# Altium project ADS1299MFMv1.PrjPcb
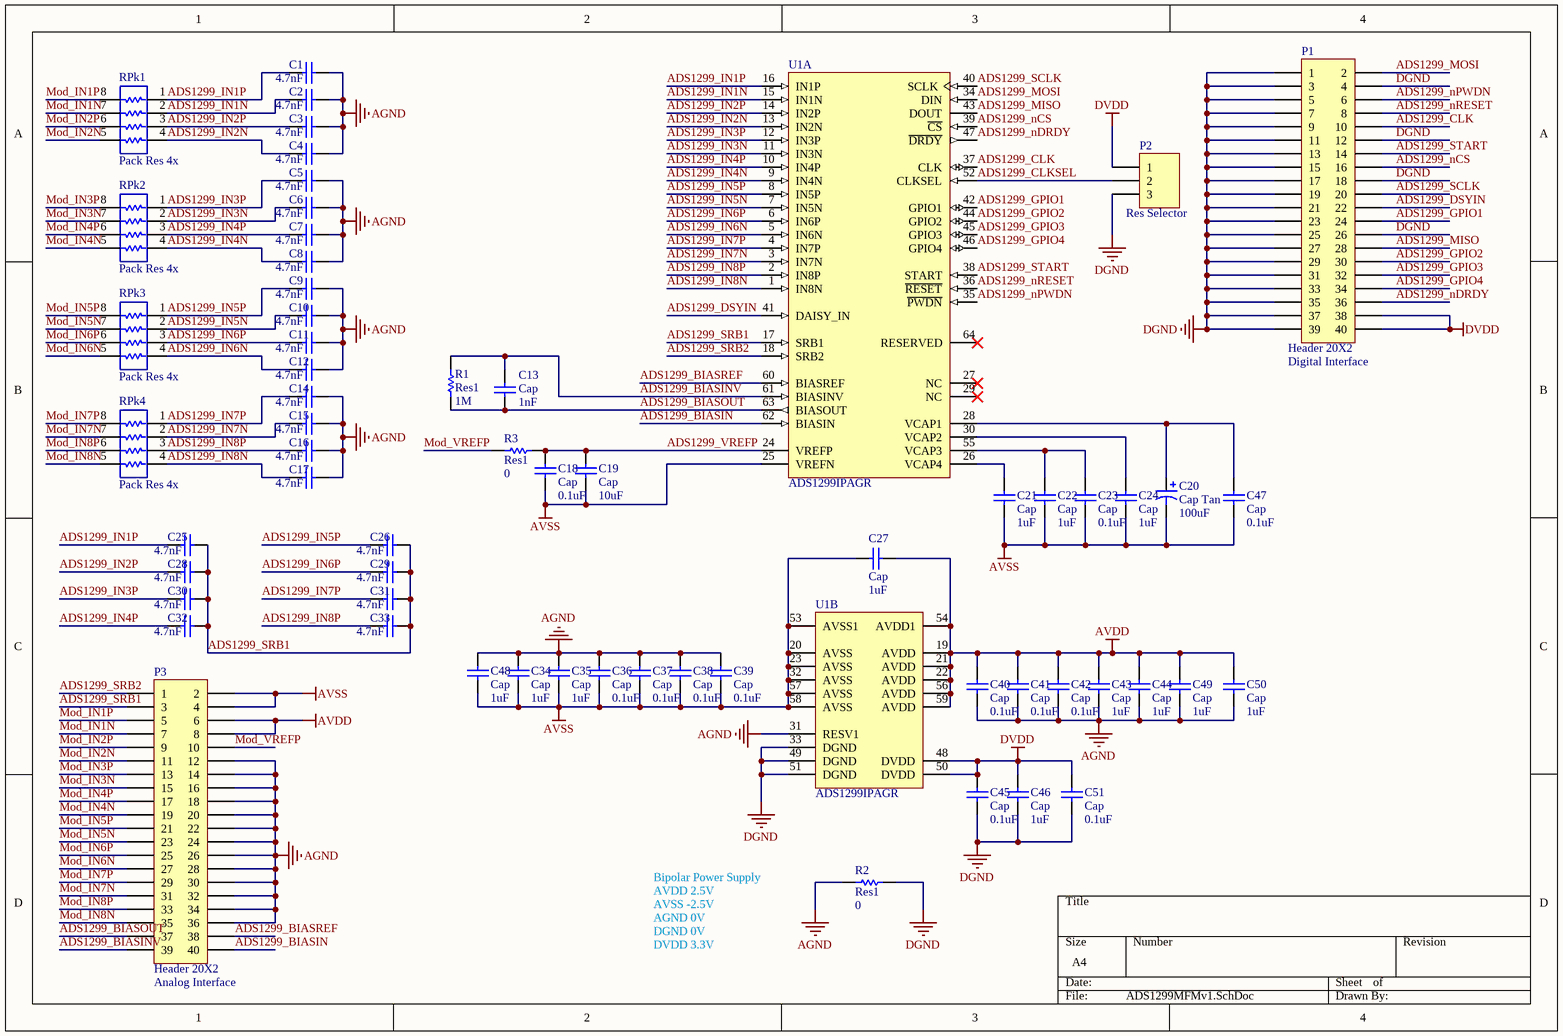
[diagram p0: ADS1299MFMv1.SchDoc]
1 sheet, 63 parts. Net scope: global (net labels, ports and power ports of the same name join across sheets).
Board file: ADS1299MFMv1.PcbDoc

## Sheet ADS1299MFMv1.SchDoc: ADS1299 Minimum Functional Module
size A4

### Parts
(Parts that share a designator on the sheet are numbered #1, #2 ... from top to bottom, then left to right.)
C1  value 4.7nF  [RESC1005N]  (hidden comment: Cap)
C2  value 4.7nF  [RESC1005N]  (hidden comment: Cap)
C3  value 4.7nF  [RESC1005N]  (hidden comment: Cap)
C4  value 4.7nF  [RESC1005N]  (hidden comment: Cap)
C5  value 4.7nF  [RESC1005N]  (hidden comment: Cap)
C6  value 4.7nF  [RESC1005N]  (hidden comment: Cap)
C7  value 4.7nF  [RESC1005N]  (hidden comment: Cap)
C8  value 4.7nF  [RESC1005N]  (hidden comment: Cap)
C9  value 4.7nF  [RESC1005N]  (hidden comment: Cap)
C10  value 4.7nF  [RESC1005N]  (hidden comment: Cap)
C11  value 4.7nF  [RESC1005N]  (hidden comment: Cap)
C12  value 4.7nF  [RESC1005N]  (hidden comment: Cap)
C13  Cap  value 1nF  [RESC1608N]
C14  value 4.7nF  [RESC1005N]  (hidden comment: Cap)
C15  value 4.7nF  [RESC1005N]  (hidden comment: Cap)
C16  value 4.7nF  [RESC1005N]  (hidden comment: Cap)
C17  value 4.7nF  [RESC1005N]  (hidden comment: Cap)
C18  Cap  value 0.1uF  [RESC1005N]
C19  Cap  value 10uF  [RESC1608N]
C20  Cap Tan  value 100uF  [TC3528-1411]
C21  Cap  value 1uF  [RESC1608N]
C22  Cap  value 1uF  [RESC1608N]
C23  Cap  value 0.1uF  [RESC1005N]
C24  Cap  value 1uF  [RESC1608N]
C25  value 4.7nF  [RESC1005N]  (hidden comment: Cap)
C26  value 4.7nF  [RESC1005N]  (hidden comment: Cap)
C27  Cap  value 1uF  [RESC1608N]
C28  value 4.7nF  [RESC1005N]  (hidden comment: Cap)
C29  value 4.7nF  [RESC1005N]  (hidden comment: Cap)
C30  value 4.7nF  [RESC1005N]  (hidden comment: Cap)
C31  value 4.7nF  [RESC1005N]  (hidden comment: Cap)
C32  value 4.7nF  [RESC1005N]  (hidden comment: Cap)
C33  value 4.7nF  [RESC1005N]  (hidden comment: Cap)
C34  Cap  value 1uF  [RESC1608N]
C35  Cap  value 1uF  [RESC1608N]
C36  Cap  value 0.1uF  [RESC1005N]
C37  Cap  value 0.1uF  [RESC1005N]
C38  Cap  value 0.1uF  [RESC1005N]
C39  Cap  value 0.1uF  [RESC1005N]
C40  Cap  value 0.1uF  [RESC1005N]
C41  Cap  value 0.1uF  [RESC1005N]
C42  Cap  value 0.1uF  [RESC1005N]
C43  Cap  value 1uF  [RESC1608N]
C44  Cap  value 1uF  [RESC1608N]
C45  Cap  value 0.1uF  [RESC1005N]
C46  Cap  value 1uF  [RESC1608N]
C47  Cap  value 0.1uF  [RESC1005N]
C48  Cap  value 1uF  [RESC1608N]
C49  Cap  value 1uF  [RESC1608N]
C50  Cap  value 1uF  [RESC1608N]
C51  Cap  value 0.1uF  [RESC1005N]
P1  Header 20X2  [FCI-B2B-0.8mm-40p]
P2  Res Selector  [RESSEL1608N]
P3  Header 20X2  [FCI-B2B-0.8mm-40p]
R1  Res1  value 1M  [RESC1608N]
R2  Res1  value 0  [RESC3216N]
R3  Res1  value 0  [RESC1608N]
RPk1  Pack Res 4x  [4X0603]
RPk2  Pack Res 4x  [4X0603]
RPk3  Pack Res 4x  [4X0603]
RPk4  Pack Res 4x  [4X0603]
U1#1  ADS1299IPAGR  [PAG0064A_L]  (part A of 2)
U1#2  ADS1299IPAGR  [PAG0064A_L]  (part B of 2)

### Nets
AGND: C1.2 C2.2 C3.2 C4.2 C5.2 C6.2 C7.2 C8.2 C9.2 C10.2 C11.2 C12.2 C14.2 C15.2 C16.2 C17.2 C34.2 C35.2 C36.2 C37.2 C38.2 C39.2 C40.1 C41.1 C42.1 C43.1 C44.1 C48.2 C49.1 C50.1 P3.12 P3.14 P3.16 P3.18 P3.20 P3.22 P3.24 P3.26 P3.28 P3.30 P3.32 P3.34 P3.36 R2.1 U1#2.31(RESV1)
AVDD: C27.1 C40.2 C41.2 C42.2 C43.2 C44.2 C49.2 C50.2 P3.6 P3.8 U1#2.19(AVDD) U1#2.21(AVDD) U1#2.22(AVDD) U1#2.54(AVDD1) U1#2.56(AVDD) U1#2.59(AVDD)
AVSS: C18.1 C19.1 C20.2 C21.1 C22.1 C23.1 C24.1 C27.2 C34.1 C35.1 C36.1 C37.1 C38.1 C39.1 C47.1 C48.1 P3.2 P3.4 U1#1.25(VREFN) U1#2.20(AVSS) U1#2.23(AVSS) U1#2.32(AVSS) U1#2.53(AVSS1) U1#2.57(AVSS) U1#2.58(AVSS)
DGND: C45.1 C46.1 C51.1 P1.1 P1.3 P1.4 P1.5 P1.7 P1.9 P1.11 P1.12 P1.13 P1.15 P1.17 P1.18 P1.19 P1.21 P1.23 P1.25 P1.26 P1.27 P1.29 P1.31 P1.33 P1.35 P1.37 P1.39 P2.3 R2.2 U1#2.33(DGND) U1#2.49(DGND) U1#2.51(DGND)
DVDD: C45.2 C46.2 C51.2 P1.38 P1.40 P2.1 U1#2.48(DVDD) U1#2.50(DVDD)
ADS1299_BIASIN: P3.40 U1#1.62(BIASIN)
ADS1299_BIASINV: C13.2 P3.39 R1.2 U1#1.61(BIASINV)
ADS1299_BIASOUT: C13.1 P3.37 R1.1 U1#1.63(BIASOUT)
ADS1299_BIASREF: P3.38 U1#1.60(BIASREF)
ADS1299_CLK: P1.10 U1#1.37(CLK)
ADS1299_CLKSEL: P2.2 U1#1.52(CLKSEL)
ADS1299_DSYIN: P1.22 U1#1.41(DAISY_IN)
ADS1299_GPIO1: P1.24 U1#1.42(GPIO1)
ADS1299_GPIO2: P1.30 U1#1.44(GPIO2)
ADS1299_GPIO3: P1.32 U1#1.45(GPIO3)
ADS1299_GPIO4: P1.34 U1#1.46(GPIO4)
ADS1299_IN1N: C2.1 RPk1.2 U1#1.15(IN1N)
ADS1299_IN1P: C1.1 C25.1 RPk1.1 U1#1.16(IN1P)
ADS1299_IN2N: C4.1 RPk1.4 U1#1.13(IN2N)
ADS1299_IN2P: C3.1 C28.1 RPk1.3 U1#1.14(IN2P)
ADS1299_IN3N: C6.1 RPk2.2 U1#1.11(IN3N)
ADS1299_IN3P: C5.1 C30.1 RPk2.1 U1#1.12(IN3P)
ADS1299_IN4N: C8.1 RPk2.4 U1#1.9(IN4N)
ADS1299_IN4P: C7.1 C32.1 RPk2.3 U1#1.10(IN4P)
ADS1299_IN5N: C10.1 RPk3.2 U1#1.7(IN5N)
ADS1299_IN5P: C9.1 C26.1 RPk3.1 U1#1.8(IN5P)
ADS1299_IN6N: C12.1 RPk3.4 U1#1.5(IN6N)
ADS1299_IN6P: C11.1 C29.1 RPk3.3 U1#1.6(IN6P)
ADS1299_IN7N: C15.1 RPk4.2 U1#1.3(IN7N)
ADS1299_IN7P: C14.1 C31.1 RPk4.1 U1#1.4(IN7P)
ADS1299_IN8N: C17.1 RPk4.4 U1#1.1(IN8N)
ADS1299_IN8P: C16.1 C33.1 RPk4.3 U1#1.2(IN8P)
ADS1299_MISO: P1.28 U1#1.43(DOUT)
ADS1299_MOSI: P1.2 U1#1.34(DIN)
ADS1299_nCS: P1.16 U1#1.39(~{CS})
ADS1299_nDRDY: P1.36 U1#1.47(~{DRDY})
ADS1299_nPWDN: P1.6 U1#1.35(~{PWDN})
ADS1299_nRESET: P1.8 U1#1.36(~{RESET})
ADS1299_SCLK: P1.20 U1#1.40(SCLK)
ADS1299_SRB1: C25.2 C26.2 C28.2 C29.2 C30.2 C31.2 C32.2 C33.2 P3.3 U1#1.17(SRB1)
ADS1299_SRB2: P3.1 U1#1.18(SRB2)
ADS1299_START: P1.14 U1#1.38(START)
ADS1299_VREFP: C18.2 C19.2 R3.1 U1#1.24(VREFP)
Mod_IN1N: P3.7 RPk1.7
Mod_IN1P: P3.5 RPk1.8
Mod_IN2N: P3.11 RPk1.5
Mod_IN2P: P3.9 RPk1.6
Mod_IN3N: P3.15 RPk2.7
Mod_IN3P: P3.13 RPk2.8
Mod_IN4N: P3.19 RPk2.5
Mod_IN4P: P3.17 RPk2.6
Mod_IN5N: P3.23 RPk3.7
Mod_IN5P: P3.21 RPk3.8
Mod_IN6N: P3.27 RPk3.5
Mod_IN6P: P3.25 RPk3.6
Mod_IN7N: P3.31 RPk4.7
Mod_IN7P: P3.29 RPk4.8
Mod_IN8N: P3.35 RPk4.5
Mod_IN8P: P3.33 RPk4.6
Mod_VREFP: P3.10 R3.2
NetC20_1: C20.1 C47.2 U1#1.28(VCAP1)
NetC21_2: C21.2 U1#1.26(VCAP4)
NetC22_2: C22.2 C23.2 U1#1.55(VCAP3)
NetC24_2: C24.2 U1#1.30(VCAP2)

Not connected (* = marked no-connect by the designer): U1#1 27(NC)* 29(NC)* 64(RESERVED)*

### Notes on the sheet
- (near P1) Digital Interface
- (near P3) Analog Interface
- Bipolar Power Supply
  AVDD 2.5V
  AVSS -2.5V
  AGND 0V
  DGND 0V
  DVDD 3.3V

### Library data of the parts
C1-C19 C21-C51 = Cap: Capacitor; Published: 8-Jun-2000; LatestRevisionDate: 17-Jul-2002; LatestRevisionNote: Re-released for DXP Platform.; PackageReference: RAD-0.3; Publisher: Altium Limited; PackageDescription: Radial Cap, Thru-Hole; 2 Leads; 0.3 in Pin Spacing
C20 = Cap Pol3: Polarized Capacitor (Surface Mount); Published: 8-Jun-2000; LatestRevisionDate: 29-May-2009; LatestRevisionNote: IPC-7351 Footprint Added.; PackageReference: C0805; Publisher: Altium Limited; PackageDescription: Chip Capacitor
P1 P3 = Header 20X2: Header, 20-Pin, Dual row; LatestRevisionDate: 17-Jul-2002; LatestRevisionNote: Re-released for DXP Platform.; Publisher: Altium Limited
P2 = Header 3: Header, 3-Pin; LatestRevisionDate: 17-Jul-2002; LatestRevisionNote: Re-released for DXP Platform.; Publisher: Altium Limited
R1-R3 = Res1: Resistor; Published: 8-Jun-2000; LatestRevisionDate: 17-Jul-2002; LatestRevisionNote: Re-released for DXP Platform.; PackageReference: AXIAL-0.3; Publisher: Altium Limited; PackageDescription: Axial Device, Thru-Hole; 2 Leads; 0.3 in Pin Spacing
RPk1-RPk4 = Res_Pack_4x: Pack Resistor 8P4R
U1#1 U1#2 = CMP-0841-00001-2: Low-Noise, 8-Channel, 24-Bit Analog Front-End for Biopotential Measurement, 16 KSPS, -40 to 85 degC, 64-Pin PQFP (PAG-64), RoHS, Tape and Reel; Manufacturer: Texas Instruments; Architecture: Delta-Sigma; Interface: Serial SPI; # Input Channels: 8; Sample Rate (max) (KSPS): 16; Packing: PAG0064A; Reference Mode: Int, Ext; Resolution (Bits): 24; PackageReference: PAG-64; ComponentLink2Description: Datasheet; Operating Temperature Range (C): -40 to 85; ComponentLink1Description: Manufacturer URL; Mounting Technology: Surface Mount; ComponentLink3Description: Package Specification; PartNumber: ADS1299IPAGR; PackageDescription: 64-Pin Plastic Quad Flatpack, Body 10 x 10 mm, Pitch 0.5 mm; ComponentLink2URL: http://www.ti.com/lit/ds/symlink/ads1299.pdf; PackageVersion: 4040282/C; ComponentLink1URL: http://www.ti.com/; ComponentLink3URL: http://www.ti.com/lit/ml/mtqf006a/mtqf006a.pdf; RoHS: TRUE; DatasheetVersion: SBAS499A